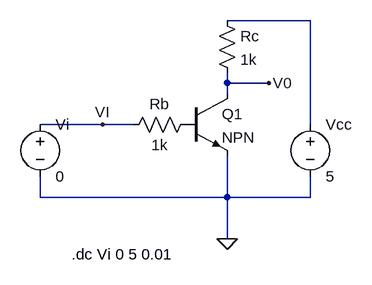
[diagram p0: schematic 1.2.1.asc]
1.2.1.asc, the LTspice schematic file:
Version 4
SHEET 1 880 680
WIRE 384 -32 256 -32
WIRE 256 64 256 48
WIRE 320 64 256 64
WIRE 256 80 256 64
WIRE 64 128 -32 128
WIRE 112 128 64 128
WIRE 384 128 384 -32
WIRE -32 240 -32 208
WIRE 256 240 256 176
WIRE 256 240 -32 240
WIRE 384 240 384 208
WIRE 384 240 256 240
WIRE 256 304 256 240
FLAG 256 304 0
FLAG 320 64 V0
FLAG 64 128 VI
SYMBOL voltage -32 112 R0
SYMATTR InstName Vi
SYMATTR Value 0
SYMBOL voltage 384 112 R0
SYMATTR InstName Vcc
SYMATTR Value 5
SYMBOL res 240 -48 R0
SYMATTR InstName Rc
SYMATTR Value 1k
SYMBOL res 208 112 R90
WINDOW 0 0 56 VBottom 2
WINDOW 3 32 56 VTop 2
SYMATTR InstName Rb
SYMATTR Value 1k
SYMBOL npn 192 80 R0
SYMATTR InstName Q1
TEXT 16 328 Left 2 !.dc Vi 0 5 0.01

The netlist it stands for:
* 1.2.1.asc
Vi VI 0 0
Vcc N001 0 5
Rc N001 V0 1k
Rb P001 VI 1k
Q1 V0 P001 0 0 NPN
.model NPN NPN
.model PNP PNP
.lib standard.bjt
.dc Vi 0 5 0.01
.backanno
.end